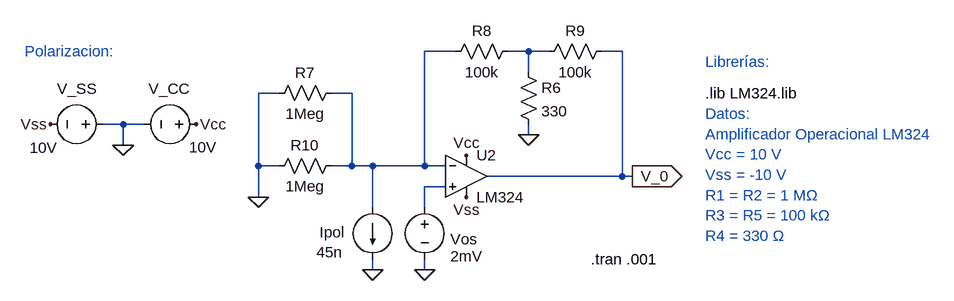
[diagram p0: schematic Lab_2_Circ_1_Ri=100k+Error CC.asc]
Lab_2_Circ_1_Ri=100k+Error CC.asc, the LTspice schematic file:
Version 4
SHEET 1 1832 680
WIRE 800 -336 752 -336
WIRE 912 -336 880 -336
WIRE 944 -336 912 -336
WIRE 1056 -336 1024 -336
WIRE 912 -304 912 -336
WIRE 528 -272 496 -272
WIRE 640 -272 608 -272
WIRE 288 -224 256 -224
WIRE 320 -224 288 -224
WIRE 912 -208 912 -224
WIRE 288 -192 288 -224
WIRE 496 -160 496 -272
WIRE 528 -160 496 -160
WIRE 640 -160 640 -272
WIRE 640 -160 608 -160
WIRE 672 -160 640 -160
WIRE 752 -160 752 -336
WIRE 752 -160 672 -160
WIRE 784 -160 752 -160
WIRE 1056 -144 1056 -336
WIRE 1056 -144 848 -144
WIRE 1072 -144 1056 -144
WIRE 784 -128 752 -128
WIRE 496 -112 496 -160
WIRE 672 -96 672 -160
WIRE 752 -96 752 -128
WIRE 672 0 672 -16
WIRE 752 0 752 -16
FLAG 400 -224 Vcc
FLAG 176 -224 Vss
FLAG 288 -192 0
FLAG 816 -176 Vcc
FLAG 816 -112 Vss
FLAG 1072 -144 V_0
IOPIN 1072 -144 Out
FLAG 912 -208 0
FLAG 752 0 0
FLAG 496 -112 0
FLAG 672 0 0
SYMBOL voltage 416 -224 R90
WINDOW 0 -55 25 VRight 2
WINDOW 3 35 -16 VRight 2
WINDOW 123 0 0 Left 0
WINDOW 39 0 0 Left 0
SYMATTR InstName V_CC
SYMATTR Value 10V
SYMBOL voltage 272 -224 R90
WINDOW 0 -55 25 VRight 2
WINDOW 3 36 85 VRight 2
WINDOW 123 0 0 Left 0
WINDOW 39 0 0 Left 0
SYMATTR InstName V_SS
SYMATTR Value 10V
SYMBOL OpAmps\\opamp2 816 -208 R0
SYMATTR InstName U2
SYMATTR Value LM324
SYMBOL res 896 -320 R0
SYMATTR InstName R6
SYMATTR Value 330
SYMBOL res 624 -288 R90
WINDOW 0 0 56 VBottom 2
WINDOW 3 32 56 VTop 2
SYMATTR InstName R7
SYMATTR Value 1Meg
SYMBOL res 784 -320 R270
WINDOW 0 32 56 VTop 2
WINDOW 3 0 56 VBottom 2
SYMATTR InstName R8
SYMATTR Value 100k
SYMBOL res 928 -320 R270
WINDOW 0 32 56 VTop 2
WINDOW 3 0 56 VBottom 2
SYMATTR InstName R9
SYMATTR Value 100k
SYMBOL res 624 -176 R90
WINDOW 0 0 56 VBottom 2
WINDOW 3 32 56 VTop 2
SYMATTR InstName R10
SYMATTR Value 1Meg
SYMBOL voltage 752 -112 R0
WINDOW 0 40 65 Left 2
WINDOW 3 40 91 Left 2
WINDOW 123 0 0 Left 0
WINDOW 39 0 0 Left 0
SYMATTR InstName Vos
SYMATTR Value 2mV
SYMBOL current 672 -96 M0
WINDOW 0 43 38 Left 2
WINDOW 3 46 69 Left 2
WINDOW 123 0 0 Left 0
WINDOW 39 0 0 Left 0
SYMATTR InstName Ipol
SYMATTR Value 45n
TEXT 1184 -272 Left 2 !.lib LM324.lib
TEXT 1184 -320 Left 2 ;Librerías:
TEXT 136 -336 Left 2 ;Polarizacion:
TEXT 1184 -240 Left 2 ;Datos:\nAmplificador Operacional LM324\nVcc = 10 V\nVss = -10 V\nR1 = R2 = 1 MΩ\nR3 = R5 = 100 kΩ\nR4 = 330 Ω
TEXT 1008 -16 Left 2 !.tran .001

The netlist it stands for:
* Lab_2_Circ_1_Ri=100k+Error CC.asc
V_CC Vcc 0 10V
V_SS 0 Vss 10V
XU2 N003 N001 Vcc Vss V_0 LM324  ; pins In+ In- V+ V- OUT
R6 N002 0 330
R7 N001 0 1Meg
R8 N001 N002 100k
R9 N002 V_0 100k
R10 N001 0 1Meg
Vos N003 0 2mV
Ipol N001 0 45n
.lib LM324.lib
* Librerías:
* Polarizacion:
* Datos:
* Amplificador Operacional LM324
* Vcc = 10 V
* Vss = -10 V
* R1 = R2 = 1 MΩ
* R3 = R5 = 100 kΩ
* R4 = 330 Ω
.tran .001
.backanno
.end